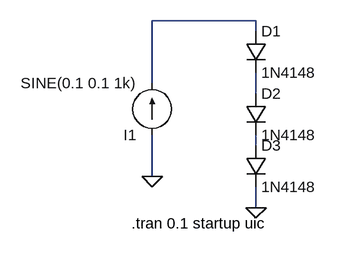
[diagram p0: schematic diode_dropout.asc]
diode_dropout.asc, the LTspice schematic file:
Version 4
SHEET 1 880 680
WIRE 336 16 176 16
WIRE 336 32 336 16
WIRE 176 112 176 16
WIRE 336 128 336 96
WIRE 336 208 336 192
WIRE 176 256 176 192
WIRE 336 304 336 272
FLAG 176 256 0
FLAG 336 304 0
SYMBOL current 176 192 R180
WINDOW 123 0 0 Left 2
WINDOW 39 0 0 Left 2
SYMATTR InstName I1
SYMATTR Value SINE(0.1 0.1 1k)
SYMBOL diode 320 32 R0
SYMATTR InstName D1
SYMATTR Value 1N4148
SYMBOL diode 320 128 R0
SYMATTR InstName D2
SYMATTR Value 1N4148
SYMBOL diode 320 208 R0
SYMATTR InstName D3
SYMATTR Value 1N4148
TEXT 144 328 Left 2 !.tran 0.1 startup uic

The netlist it stands for:
* diode_dropout.asc
I1 0 N001 SINE(0.1 0.1 1k)
D1 N001 N002 1N4148
D2 N002 N003 1N4148
D3 N003 0 1N4148
.model D D
.lib standard.dio
.tran 0.1 startup uic
.backanno
.end